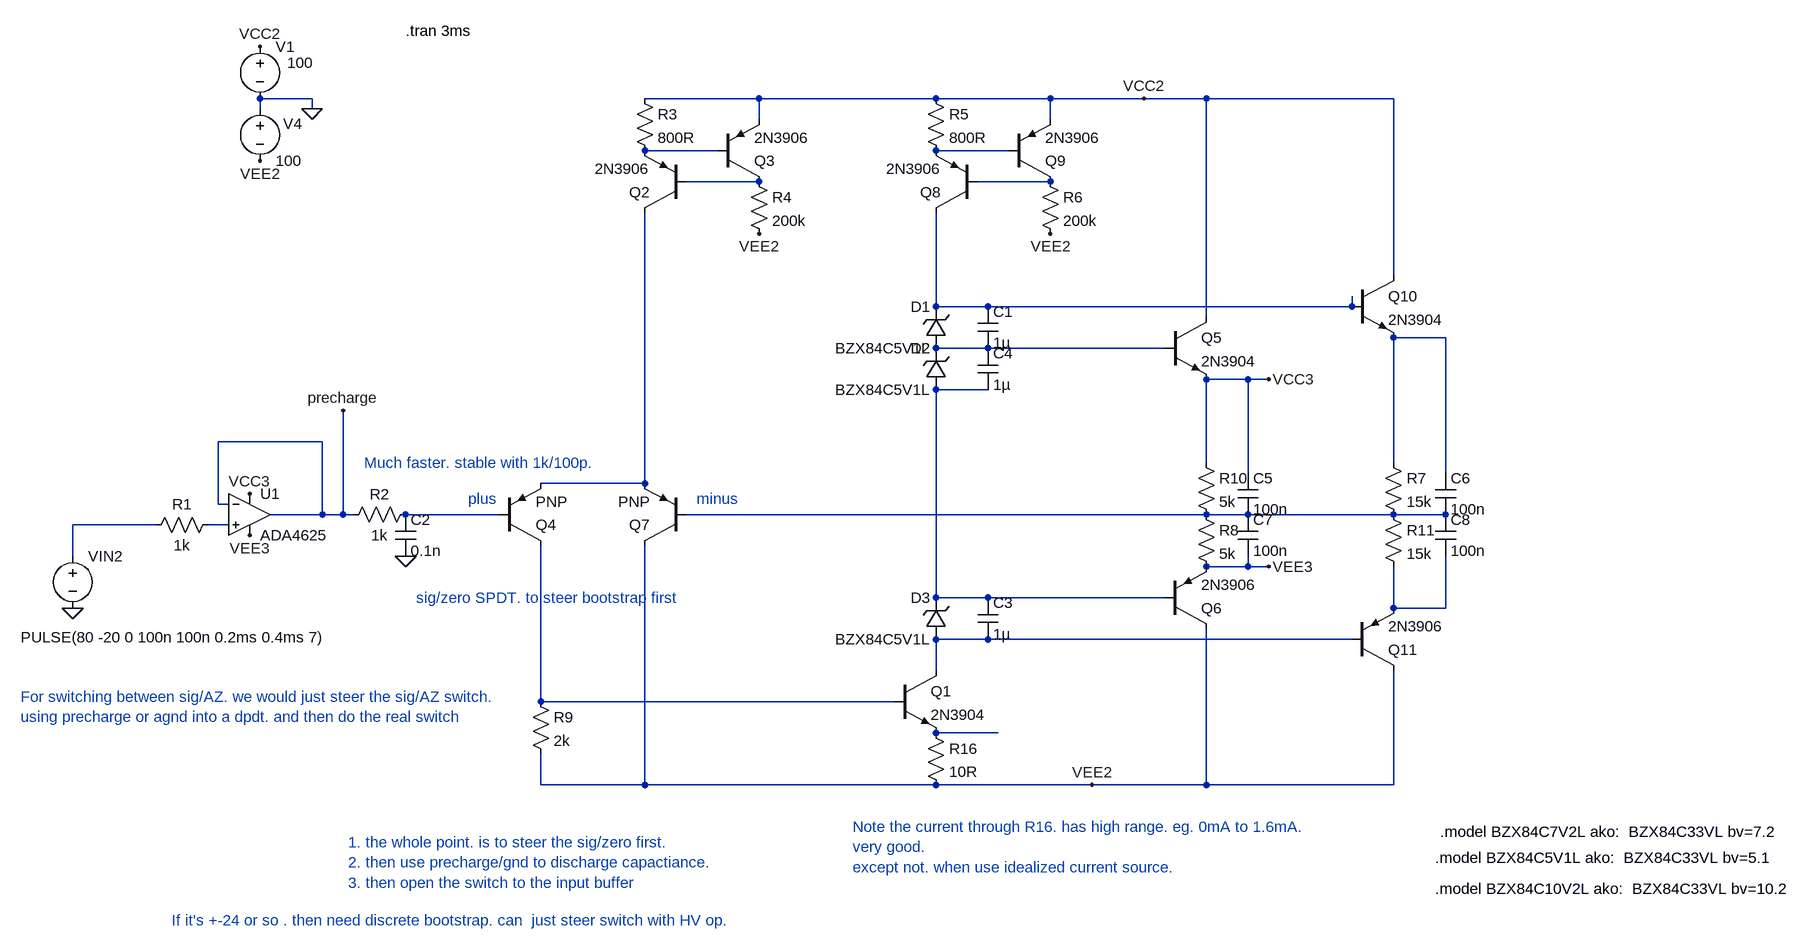
[diagram p0: schematic Draft53.asc]
Draft53.asc, the LTspice schematic file:
Version 4
SHEET 1 2756 992
WIRE -256 -288 -336 -288
WIRE 432 -288 256 -288
WIRE 704 -288 432 -288
WIRE 880 -288 704 -288
WIRE 1024 -288 880 -288
WIRE 1120 -288 1024 -288
WIRE 1408 -288 1120 -288
WIRE -336 -272 -336 -288
WIRE -256 -272 -256 -288
WIRE 432 -256 432 -288
WIRE 880 -256 880 -288
WIRE 368 -208 256 -208
WIRE 816 -208 704 -208
WIRE 432 -160 320 -160
WIRE 880 -160 768 -160
WIRE 1408 -16 1408 -288
WIRE 704 32 704 -112
WIRE 784 32 704 32
WIRE 1344 32 1344 16
WIRE 1344 32 784 32
WIRE 1120 48 1120 -288
WIRE 1488 80 1408 80
WIRE 784 96 704 96
WIRE 1056 96 784 96
WIRE 1184 144 1120 144
WIRE 1216 144 1184 144
WIRE 784 160 704 160
WIRE -240 240 -400 240
WIRE 1120 272 1120 144
WIRE 1408 272 1408 80
WIRE 1184 288 1184 144
WIRE 1488 288 1488 80
WIRE 256 304 256 -112
WIRE 256 304 96 304
WIRE -400 336 -400 240
WIRE -384 336 -400 336
WIRE -240 352 -240 240
WIRE -240 352 -320 352
WIRE -208 352 -208 192
WIRE -208 352 -240 352
WIRE -192 352 -208 352
WIRE 32 352 -112 352
WIRE 1120 352 320 352
WIRE 1184 352 1120 352
WIRE 1408 352 1184 352
WIRE 1488 352 1408 352
WIRE -496 368 -624 368
WIRE -384 368 -416 368
WIRE -624 416 -624 368
WIRE 1184 432 1184 416
WIRE 1184 432 1120 432
WIRE 1216 432 1184 432
WIRE 704 480 704 160
WIRE 784 480 704 480
WIRE 1056 480 784 480
WIRE 1408 496 1408 432
WIRE 1488 496 1488 416
WIRE 1488 496 1408 496
WIRE 784 544 704 544
WIRE 1344 544 784 544
WIRE 704 592 704 544
WIRE 96 640 96 400
WIRE 640 640 96 640
WIRE 800 688 704 688
WIRE 96 768 96 720
WIRE 256 768 256 400
WIRE 256 768 96 768
WIRE 704 768 256 768
WIRE 944 768 704 768
WIRE 1120 768 1120 528
WIRE 1120 768 944 768
WIRE 1408 768 1408 592
WIRE 1408 768 1120 768
FLAG -256 -272 0
FLAG -336 -368 VCC2
FLAG -336 -192 VEE2
FLAG 944 768 VEE2
FLAG -624 496 0
FLAG 1216 144 VCC3
FLAG 1216 432 VEE3
FLAG -352 320 VCC3
FLAG -352 384 VEE3
FLAG -112 416 0
FLAG 432 -80 VEE2
FLAG 1024 -288 VCC2
FLAG 880 -80 VEE2
FLAG -208 192 precharge
SYMBOL voltage -336 -384 R0
WINDOW 123 0 0 Left 0
WINDOW 39 0 0 Left 0
WINDOW 3 42 41 Left 2
SYMATTR Value 100
SYMATTR InstName V1
SYMBOL voltage -336 -288 R0
WINDOW 123 0 0 Left 0
WINDOW 39 0 0 Left 0
WINDOW 0 36 39 Left 2
SYMATTR InstName V4
SYMATTR Value 100
SYMBOL npn 1056 48 R0
SYMATTR InstName Q5
SYMATTR Value 2N3904
SYMBOL pnp 1056 528 M180
SYMATTR InstName Q6
SYMATTR Value 2N3906
SYMBOL res 80 624 R0
SYMATTR InstName R9
SYMATTR Value 2k
SYMBOL res 688 672 R0
SYMATTR InstName R16
SYMATTR Value 10R
SYMBOL pnp 32 400 M180
SYMATTR InstName Q4
SYMBOL pnp 320 400 R180
SYMATTR InstName Q7
SYMBOL voltage -624 400 R0
WINDOW 123 0 0 Left 0
WINDOW 39 0 0 Left 0
WINDOW 3 -80 141 Left 2
SYMATTR Value PULSE(80 -20 0 100n 100n 0.2ms 0.4ms 7)
SYMATTR InstName VIN2
SYMBOL res -400 352 R90
WINDOW 0 0 56 VBottom 2
WINDOW 3 32 56 VTop 2
SYMATTR InstName R1
SYMATTR Value 1k
SYMBOL res -96 336 R90
WINDOW 0 0 56 VBottom 2
WINDOW 3 32 56 VTop 2
SYMATTR InstName R2
SYMATTR Value 1k
SYMBOL cap -128 352 R0
SYMATTR InstName C2
SYMATTR Value 0.1n
SYMBOL cap 768 96 R0
SYMATTR InstName C4
SYMATTR Value 1µ
SYMBOL OpAmps\\ADA4625 -352 288 R0
SYMATTR InstName U1
SYMBOL zener 720 160 R180
WINDOW 0 24 64 Left 2
WINDOW 3 24 0 Left 2
SYMATTR InstName D2
SYMATTR Value BZX84C5V1L
SYMBOL npn 640 592 R0
SYMATTR InstName Q1
SYMATTR Value 2N3904
SYMBOL pnp 320 -112 R180
SYMATTR InstName Q2
SYMATTR Value 2N3906
SYMBOL pnp 368 -160 M180
SYMATTR InstName Q3
SYMATTR Value 2N3906
SYMBOL res 240 -304 R0
SYMATTR InstName R3
SYMATTR Value 800R
SYMBOL res 416 -176 R0
SYMATTR InstName R4
SYMATTR Value 200k
SYMBOL pnp 768 -112 R180
SYMATTR InstName Q8
SYMATTR Value 2N3906
SYMBOL pnp 816 -160 M180
SYMATTR InstName Q9
SYMATTR Value 2N3906
SYMBOL res 688 -304 R0
SYMATTR InstName R5
SYMATTR Value 800R
SYMBOL res 864 -176 R0
SYMATTR InstName R6
SYMATTR Value 200k
SYMBOL res 1104 336 R0
SYMATTR InstName R8
SYMATTR Value 5k
SYMBOL res 1104 256 R0
SYMATTR InstName R10
SYMATTR Value 5k
SYMBOL zener 720 96 R180
WINDOW 0 24 64 Left 2
WINDOW 3 24 0 Left 2
SYMATTR InstName D1
SYMATTR Value BZX84C5V1L
SYMBOL cap 768 32 R0
SYMATTR InstName C1
SYMATTR Value 1µ
SYMBOL zener 720 544 R180
WINDOW 0 24 64 Left 2
WINDOW 3 24 0 Left 2
SYMATTR InstName D3
SYMATTR Value BZX84C5V1L
SYMBOL cap 768 480 R0
SYMATTR InstName C3
SYMATTR Value 1µ
SYMBOL npn 1344 -16 R0
SYMATTR InstName Q10
SYMATTR Value 2N3904
SYMBOL pnp 1344 592 M180
SYMATTR InstName Q11
SYMATTR Value 2N3906
SYMBOL res 1392 256 R0
SYMATTR InstName R7
SYMATTR Value 15k
SYMBOL res 1392 336 R0
SYMATTR InstName R11
SYMATTR Value 15k
SYMBOL cap 1168 288 R0
SYMATTR InstName C5
SYMATTR Value 100n
SYMBOL cap 1472 288 R0
SYMATTR InstName C6
SYMATTR Value 100n
SYMBOL cap 1168 352 R0
SYMATTR InstName C7
SYMATTR Value 100n
SYMBOL cap 1472 352 R0
SYMATTR InstName C8
SYMATTR Value 100n
TEXT -112 -392 Left 2 !.tran 3ms
TEXT 336 328 Left 2 ;minus
TEXT 576 832 Left 2 ;Note the current through R16. has high range. eg. 0mA to 1.6mA.\nvery good.\nexcept not. when use idealized current source.
TEXT -16 328 Left 2 ;plus
TEXT 1472 880 Left 2 !.model BZX84C5V1L ako:  BZX84C33VL bv=5.1
TEXT 1480 840 Left 2 !.model BZX84C7V2L ako:  BZX84C33VL bv=7.2
TEXT -176 272 Left 2 ;Much faster. stable with 1k/100p.
TEXT 1472 928 Left 2 !.model BZX84C10V2L ako:  BZX84C33VL bv=10.2
TEXT -704 632 Left 2 ;For switching between sig/AZ. we would just steer the sig/AZ switch.\nusing precharge or agnd into a dpdt. and then do the real switch
TEXT -96 480 Left 2 ;sig/zero SPDT. to steer bootstrap first
TEXT -200 856 Left 2 ;1. the whole point. is to steer the sig/zero first. \n2. then use precharge/gnd to discharge capactiance.\n3. then open the switch to the input buffer
TEXT -472 976 Left 2 ;If it's +-24 or so . then need discrete bootstrap. can  just steer switch with HV op.

The netlist it stands for:
* Draft53.asc
V1 VCC2 0 100
V4 0 VEE2 100
Q5 VCC2 N007 VCC3 0 2N3904
Q6 VEE2 N008 VEE3 0 2N3906
R9 N016 VEE2 2k
R16 N017 VEE2 10R
Q4 N016 N010 N009 0 PNP
Q7 VEE2 N011 N009 0 PNP
VIN2 N012 0 PULSE(80 -20 0 100n 100n 0.2ms 0.4ms 7)
R1 N013 N012 1k
R2 N010 precharge 1k
C2 N010 0 0.1n
C4 N007 N008 1µ
XU1 N013 precharge VCC3 VEE3 precharge ADA4625  ; pins In+ In- V+ V- OUT
D2 N008 N007 BZX84C5V1L
Q1 N015 N016 N017 0 2N3904
Q2 N009 N003 N001 0 2N3906
Q3 N003 N001 VCC2 0 2N3906
R3 VCC2 N001 800R
R4 N003 VEE2 200k
Q8 N005 N004 N002 0 2N3906
Q9 N004 N002 VCC2 0 2N3906
R5 VCC2 N002 800R
R6 N004 VEE2 200k
R8 N011 VEE3 5k
R10 VCC3 N011 5k
D1 N007 N005 BZX84C5V1L
C1 N005 N007 1µ
D3 N015 N008 BZX84C5V1L
C3 N008 N015 1µ
Q10 VCC2 N005 N006 0 2N3904
Q11 VEE2 N015 N014 0 2N3906
R7 N006 N011 15k
R11 N011 N014 15k
C5 VCC3 N011 100n
C6 N006 N011 100n
C7 N011 VEE3 100n
C8 N011 N014 100n
.model D D
.lib standard.dio
.model NPN NPN
.model PNP PNP
.lib standard.bjt
.tran 3ms
* minus
* Note the current through R16. has high range. eg. 0mA to 1.6mA.
* very good.
* except not. when use idealized current source.
* plus
.model BZX84C5V1L ako:  BZX84C33VL bv=5.1
.model BZX84C7V2L ako:  BZX84C33VL bv=7.2
* Much faster. stable with 1k/100p.
.model BZX84C10V2L ako:  BZX84C33VL bv=10.2
* For switching between sig/AZ. we would just steer the sig/AZ switch.
* using precharge or agnd into a dpdt. and then do the real switch
* sig/zero SPDT. to steer bootstrap first
* 1. the whole point. is to steer the sig/zero first.
* 2. then use precharge/gnd to discharge capactiance.
* 3. then open the switch to the input buffer
* If it's +-24 or so . then need discrete bootstrap. can  just steer switch with HV op.
.backanno
.end